# Altium project ArDINo.PrjPCB
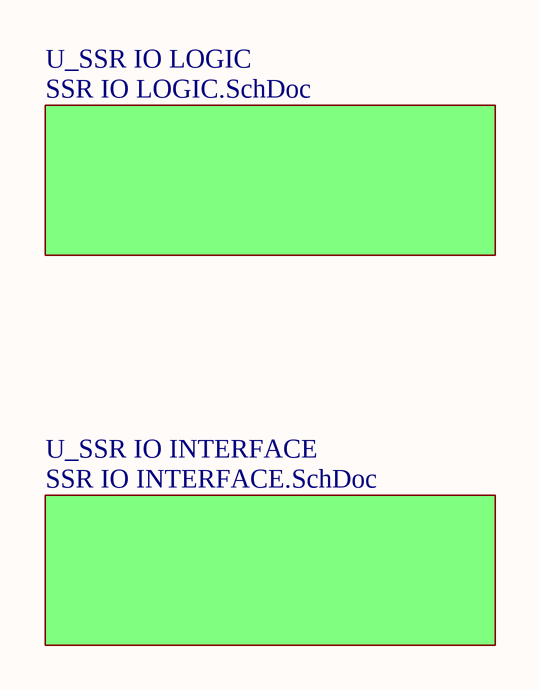
[diagram p0: DINOBUS.SchDoc]
4 sheets, 152 parts. Net scope: global (net labels, ports and power ports of the same name join across sheets).
Board files: SSR IO INTERFACE.PcbDoc, DINOBUS NODE CONTROLLER.PcbDoc, DUAL OC OUTPUT.PcbDoc
Sheets:
  DINOBUS.SchDoc
    U_SSR IO INTERFACE = SSR IO INTERFACE.SchDoc
  DINOBUS NODE CONTROLLER.SchDoc
  DUAL OC OUTPUT.SchDoc

## Sheet DINOBUS.SchDoc: document title
size C; ApprovedBy: Vincent Himpe; CheckedBy: Vincent Himpe; Author: Vincent Himpe; CompanyName: STMicroelectronics; DrawnBy: Vincent Himpe; Organization: BCD Application; Address1: 2525 Augustine Drive; Address2: Santa Clara 95054 CA; Address3: USA; Revision: A; Project: Project title; DrawnByContact: +1 (408) 451 8116; DrawnByEmail: vincent.himpe@st.com

### Sub-sheets
U_SSR IO INTERFACE = SSR IO INTERFACE.SchDoc: no entries
U_SSR IO LOGIC = SSR IO LOGIC.SchDoc (file not in this document): no entries

### Notes on the sheet
- PROJECT
- STMicroelectronics
- Last Modified
- Sheet
- of
- Document
- Revision
- Drawn By
- Information in this document is the intellectual property of STMicroelectronics.Disclosure outside of STMicroelectronics is prohibited without prior written approval. Contents may be subject to Patent or Patent application.
- 2525 Augustine Drive
- Santa Clara 95054 CA
- USA

## Sheet SSR IO INTERFACE.SchDoc: document title
size C; ApprovedBy: Vincent Himpe; CheckedBy: Vincent Himpe; Author: Vincent Himpe; CompanyName: STMicroelectronics; DrawnBy: Vincent Himpe; Organization: BCD Application; Address1: 2525 Augustine Drive; Address2: Santa Clara 95054 CA; Address3: USA; Revision: A; Project: Project title; DrawnByContact: +1 (408) 451 8116; DrawnByEmail: vincent.himpe@st.com
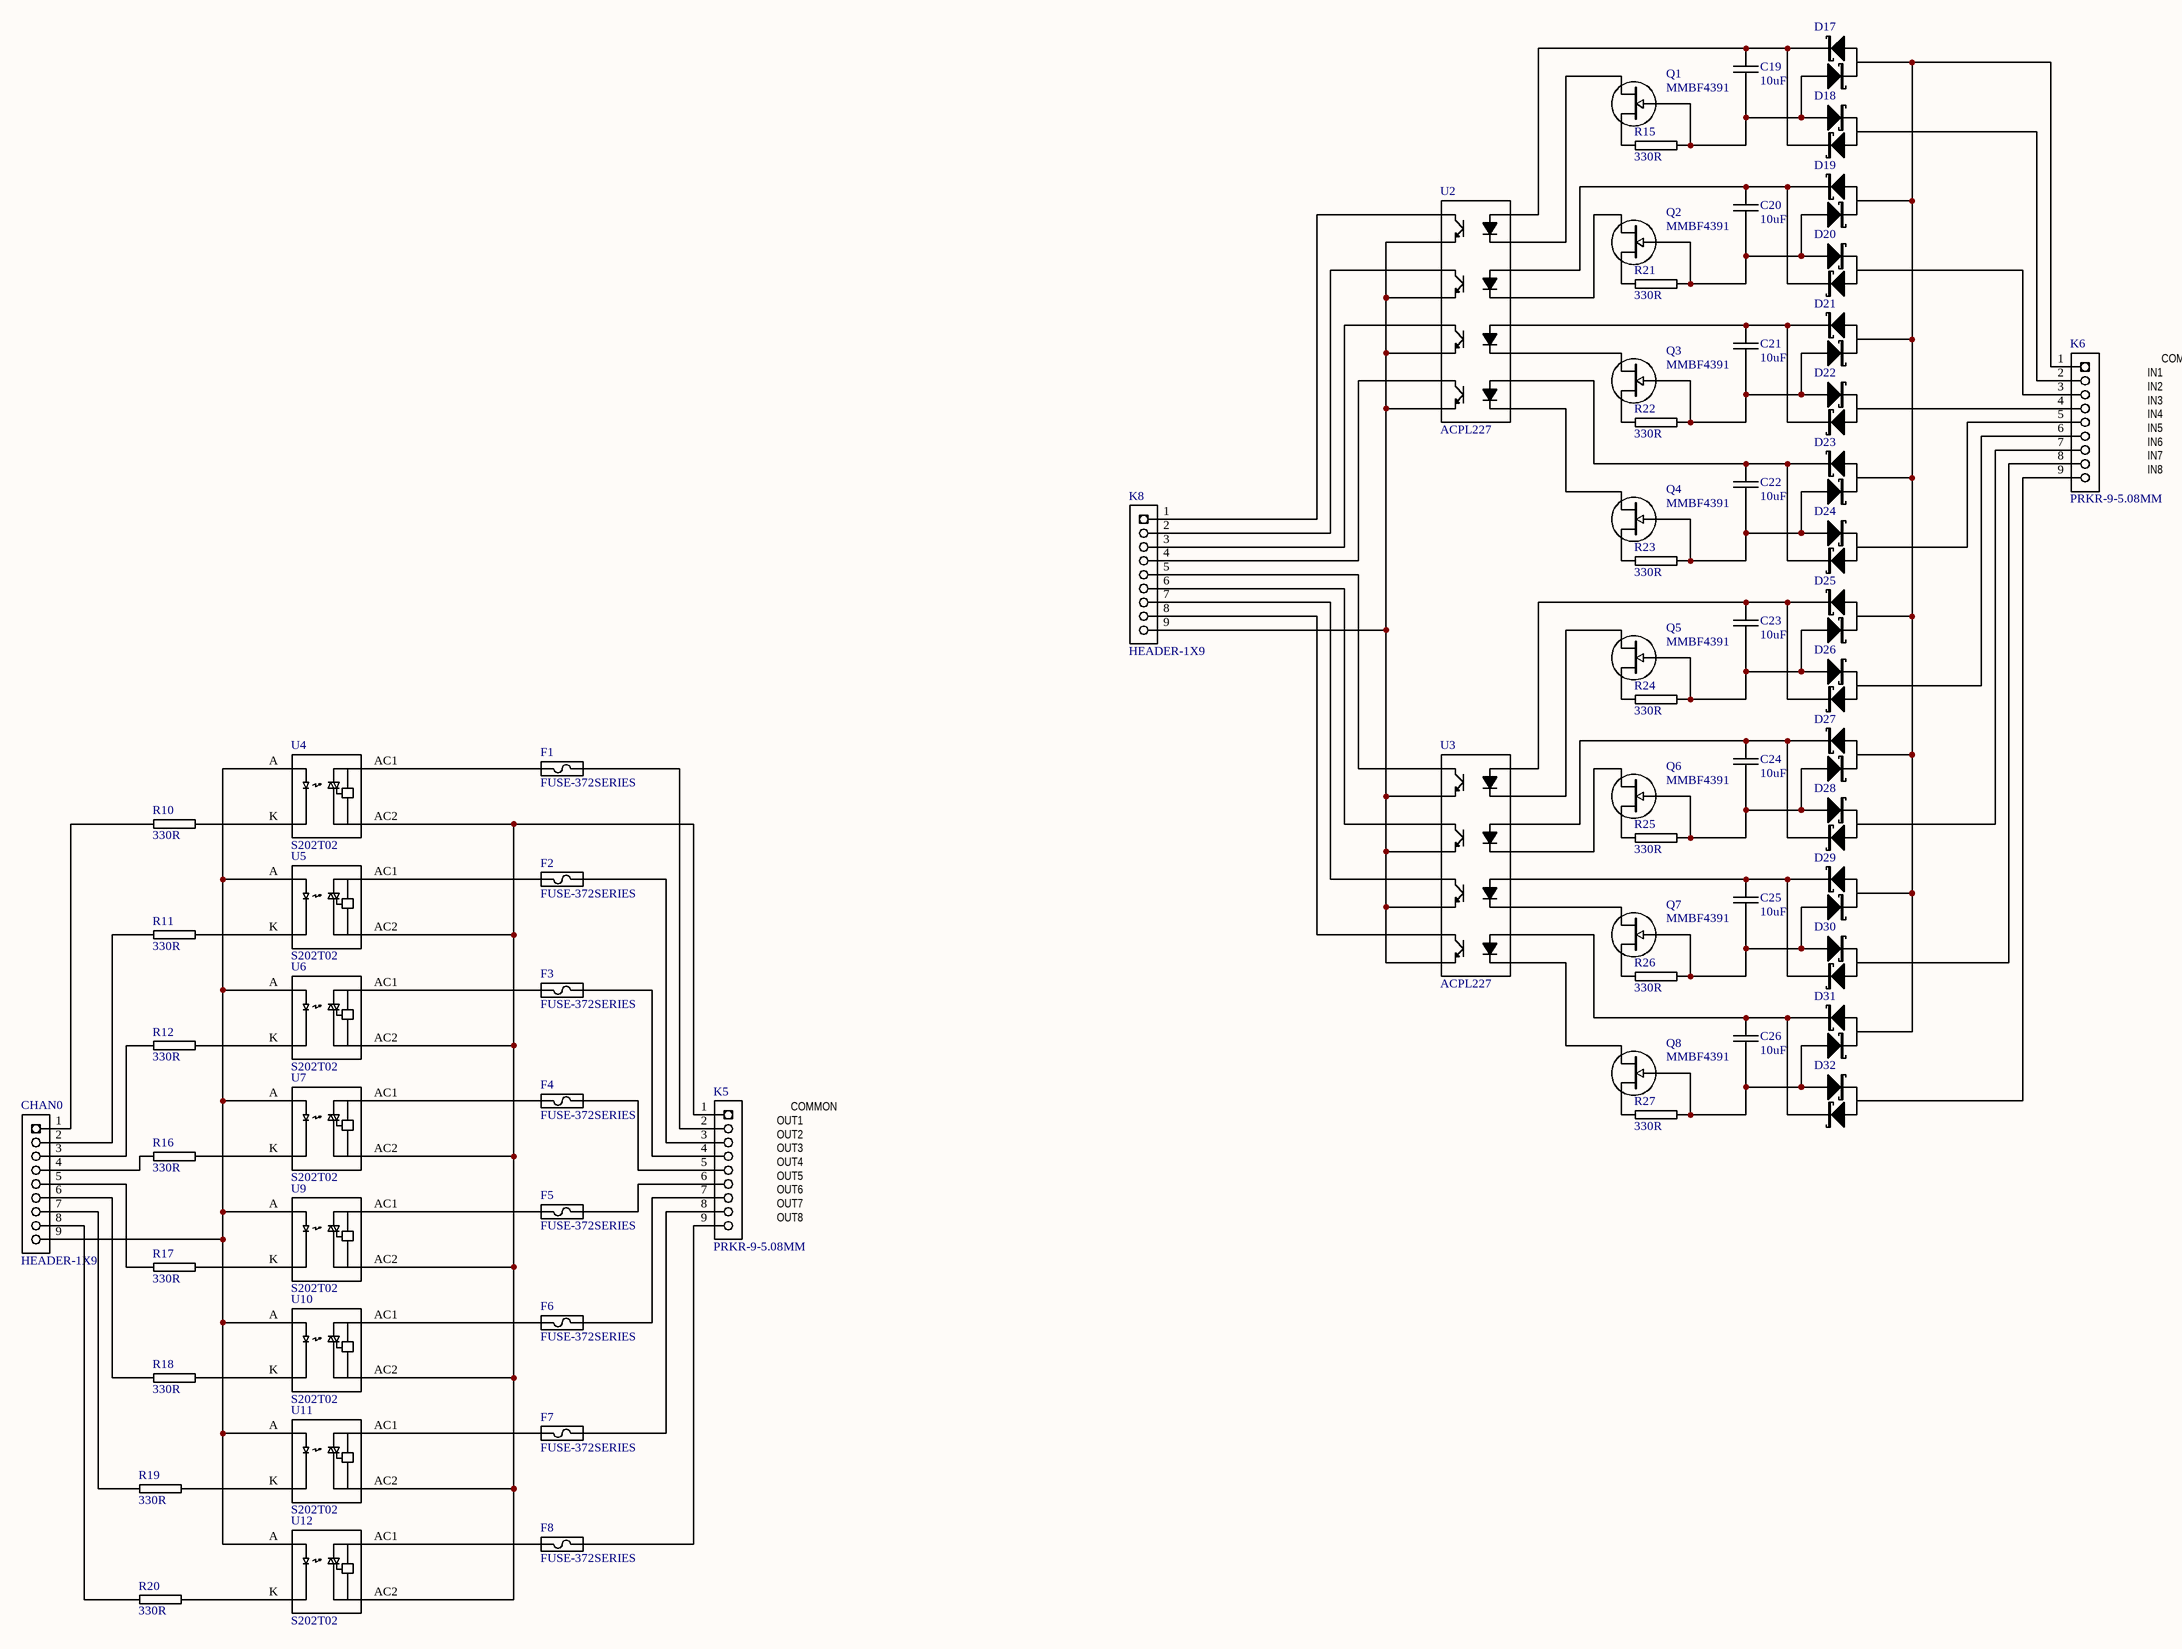
[diagram p1: SSR IO INTERFACE.SchDoc]

### Parts
(Parts that share a designator on the sheet are numbered #1, #2 ... from top to bottom, then left to right.)
C19  10uF  [1210C-GENERIC]
C20  10uF  [1210C-GENERIC]
C21  10uF  [1210C-GENERIC]
C22  10uF  [1210C-GENERIC]
C23  10uF  [1210C-GENERIC]
C24  10uF  [1210C-GENERIC]
C25  10uF  [1210C-GENERIC]
C26  10uF  [1210C-GENERIC]
CHAN0#1  HEADER-1X9  [HEADER-1X9]
D17  BAT54S-SOT23  [SOT23-123]  (value not drawn)
D18  BAT54S-SOT23  [SOT23-123]  (value not drawn)
D19  BAT54S-SOT23  [SOT23-123]  (value not drawn)
D20  BAT54S-SOT23  [SOT23-123]  (value not drawn)
D21  BAT54S-SOT23  [SOT23-123]  (value not drawn)
D22  BAT54S-SOT23  [SOT23-123]  (value not drawn)
D23  BAT54S-SOT23  [SOT23-123]  (value not drawn)
D24  BAT54S-SOT23  [SOT23-123]  (value not drawn)
D25  BAT54S-SOT23  [SOT23-123]  (value not drawn)
D26  BAT54S-SOT23  [SOT23-123]  (value not drawn)
D27  BAT54S-SOT23  [SOT23-123]  (value not drawn)
D28  BAT54S-SOT23  [SOT23-123]  (value not drawn)
D29  BAT54S-SOT23  [SOT23-123]  (value not drawn)
D30  BAT54S-SOT23  [SOT23-123]  (value not drawn)
D31  BAT54S-SOT23  [SOT23-123]  (value not drawn)
D32  BAT54S-SOT23  [SOT23-123]  (value not drawn)
F1#1  FUSE-372SERIES  [FUSE-372]
F2  FUSE-372SERIES  [FUSE-372]
F3  FUSE-372SERIES  [FUSE-372]
F4  FUSE-372SERIES  [FUSE-372]
F5  FUSE-372SERIES  [FUSE-372]
F6  FUSE-372SERIES  [FUSE-372]
F7  FUSE-372SERIES  [FUSE-372]
F8  FUSE-372SERIES  [FUSE-372]
K5#1  PRKR-9-5.08MM  [PRKR-9-5.08MM]
K6  PRKR-9-5.08MM  [PRKR-9-5.08MM]
K8  HEADER-1X9  [HEADER-1X9]
Q1#1  MMBF4391  [SOT23-DSG]
Q2  MMBF4391  [SOT23-DSG]
Q3  MMBF4391  [SOT23-DSG]
Q4  MMBF4391  [SOT23-DSG]
Q5  MMBF4391  [SOT23-DSG]
Q6  MMBF4391  [SOT23-DSG]
Q7  MMBF4391  [SOT23-DSG]
Q8  MMBF4391  [SOT23-DSG]
R10  330R  [0805R-330]
R11  330R  [0805R-330]
R12  330R  [0805R-330]
R15  330R  [0805R-330]
R16  330R  [0805R-330]
R17  330R  [0805R-330]
R18  330R  [0805R-330]
R19  330R  [0805R-330]
R20  330R  [0805R-330]
R21  330R  [0805R-330]
R22  330R  [0805R-330]
R23  330R  [0805R-330]
R24  330R  [0805R-330]
R25  330R  [0805R-330]
R26  330R  [0805R-330]
R27  330R  [0805R-330]
U2#1  ACPL227  [SO16]
U3#1  ACPL227  [SO16]
U4#1  S202T02  [S202T02]
U5#1  S202T02  [S202T02]
U6  S202T02  [S202T02]
U7  S202T02  [S202T02]
U9  S202T02  [S202T02]
U10  S202T02  [S202T02]
U11  S202T02  [S202T02]
U12  S202T02  [S202T02]

### Nets
NetC19_1: C19.1 D17.2 D18.2 U2#1.1(A1)
NetC19_2: C19.2 D17.1 D18.1 Q1#1.G R15.2
NetC20_1: C20.1 D19.2 D20.2 U2#1.3(A2)
NetC20_2: C20.2 D19.1 D20.1 Q2.G R21.2
NetC21_1: C21.1 D21.2 D22.2 U2#1.5(A3)
NetC21_2: C21.2 D21.1 D22.1 Q3.G R22.2
NetC22_1: C22.1 D23.2 D24.2 U2#1.7(A4)
NetC22_2: C22.2 D23.1 D24.1 Q4.G R23.2
NetC23_1: C23.1 D25.2 D26.2 U3#1.1(A1)
NetC23_2: C23.2 D25.1 D26.1 Q5.G R24.2
NetC24_1: C24.1 D27.2 D28.2 U3#1.3(A2)
NetC24_2: C24.2 D27.1 D28.1 Q6.G R25.2
NetC25_1: C25.1 D29.2 D30.2 U3#1.5(A3)
NetC25_2: C25.2 D29.1 D30.1 Q7.G R26.2
NetC26_1: C26.1 D31.2 D32.2 U3#1.7(A4)
NetC26_2: C26.2 D31.1 D32.1 Q8.G R27.2
NetCHAN0#1_1: CHAN0#1.1 R10.1
NetCHAN0#1_2: CHAN0#1.2 R11.1
NetCHAN0#1_3: CHAN0#1.3 R12.1
NetCHAN0#1_4: CHAN0#1.4 R16.1
NetCHAN0#1_5: CHAN0#1.5 R17.1
NetCHAN0#1_6: CHAN0#1.6 R18.1
NetCHAN0#1_7: CHAN0#1.7 R19.1
NetCHAN0#1_8: CHAN0#1.8 R20.1
NetCHAN0#1_9: CHAN0#1.9 U4#1.A U5#1.A U6.A U7.A U9.A U10.A U11.A U12.A
NetD17_3: D17.3 D19.3 D21.3 D23.3 D25.3 D27.3 D29.3 D31.3 K6.1
NetD18_3: D18.3 K6.2
NetD20_3: D20.3 K6.3
NetD22_3: D22.3 K6.4
NetD24_3: D24.3 K6.5
NetD26_3: D26.3 K6.6
NetD28_3: D28.3 K6.7
NetD30_3: D30.3 K6.8
NetD32_3: D32.3 K6.9
NetF1#1_1: F1#1.1 K5#1.2
NetF1#1_2: F1#1.2 U4#1.AC1
NetF2_1: F2.1 K5#1.3
NetF2_2: F2.2 U5#1.AC1
NetF3_1: F3.1 K5#1.4
NetF3_2: F3.2 U6.AC1
NetF4_1: F4.1 K5#1.5
NetF4_2: F4.2 U7.AC1
NetF5_1: F5.1 K5#1.6
NetF5_2: F5.2 U9.AC1
NetF6_1: F6.1 K5#1.7
NetF6_2: F6.2 U10.AC1
NetF7_1: F7.1 K5#1.8
NetF7_2: F7.2 U11.AC1
NetF8_1: F8.1 K5#1.9
NetF8_2: F8.2 U12.AC1
NetK5#1_1: K5#1.1 U4#1.AC2 U5#1.AC2 U6.AC2 U7.AC2 U9.AC2 U10.AC2 U11.AC2 U12.AC2
NetK8_1: K8.1 U2#1.16(C1)
NetK8_2: K8.2 U2#1.14(C2)
NetK8_3: K8.3 U2#1.12(C3)
NetK8_4: K8.4 U2#1.10(C4)
NetK8_5: K8.5 U3#1.16(C1)
NetK8_6: K8.6 U3#1.14(C2)
NetK8_7: K8.7 U3#1.12(C3)
NetK8_8: K8.8 U3#1.10(C4)
NetK8_9: K8.9 U2#1.9(E4) U2#1.11(E3) U2#1.13(E2) U2#1.15(E1) U3#1.9(E4) U3#1.11(E3) U3#1.13(E2) U3#1.15(E1)
NetQ1#1_D: Q1#1.D U2#1.2(K1)
NetQ1#1_S: Q1#1.S R15.1
NetQ2_D: Q2.D U2#1.4(K2)
NetQ2_S: Q2.S R21.1
NetQ3_D: Q3.D U2#1.6(K3)
NetQ3_S: Q3.S R22.1
NetQ4_D: Q4.D U2#1.8(K4)
NetQ4_S: Q4.S R23.1
NetQ5_D: Q5.D U3#1.2(K1)
NetQ5_S: Q5.S R24.1
NetQ6_D: Q6.D U3#1.4(K2)
NetQ6_S: Q6.S R25.1
NetQ7_D: Q7.D U3#1.6(K3)
NetQ7_S: Q7.S R26.1
NetQ8_D: Q8.D U3#1.8(K4)
NetQ8_S: Q8.S R27.1
NetR10_2: R10.2 U4#1.K
NetR11_2: R11.2 U5#1.K
NetR12_2: R12.2 U6.K
NetR16_2: R16.2 U7.K
NetR17_2: R17.2 U9.K
NetR18_2: R18.2 U10.K
NetR19_2: R19.2 U11.K
NetR20_2: R20.2 U12.K

### Notes on the sheet
- (near K6) IN1
- (near K6) IN2
- (near K6) IN3
- (near K6) COMMON
- (near K6) IN4
- (near K6) IN5
- (near K6) IN6
- (near K6) IN7
- (near K6) IN8
- (near K5#1) OUT1
- (near K5#1) OUT2
- (near K5#1) OUT3
- (near K5#1) OUT4
- (near K5#1) COMMON
- (near K5#1) OUT5
- (near K5#1) OUT6
- (near K5#1) OUT7
- (near K5#1) OUT8
- PROJECT
- STMicroelectronics
- Last Modified
- Sheet
- of
- Document
- Revision
- Drawn By
- Information in this document is the intellectual property of STMicroelectronics.Disclosure outside of STMicroelectronics is prohibited without prior written approval. Contents may be subject to Patent or Patent application.
- 2525 Augustine Drive
- Santa Clara 95054 CA
- USA

### Library data of the parts
C19-C26 = 1210C-10UF-50V-TDK: GENERIC CAPACITOR NON POLARISED 1210; REEL: C87; Supplier 1: Digi-Key; Supplier Part Number 1: 445-4537-2-ND
D17-D32 = BAT54S-SOT23: DUAL SCHOTTKY DIODE SERIES; Manufacturer Part Number: BAT54S,215; Manufacturer: NXP Semiconductors; Voltage - DC Reverse (Vr) (Max): 30V; Speed: Small Signal =< 200mA (Io), Any Speed; Current - Reverse Leakage @ Vr: 2µA @ 25V; Diode Configuration: 1 Pair Series Connection; Voltage - Forward (Vf) (Max) @ If: 800mV @ 100mA; Current - Average Rectified (Io) (per Diode): 200mA (DC); Reverse Recovery Time (trr): 5ns; Description: DIODE SCHOTTKY 30V DUAL SOT23; Supplier 1: Digi-Key; Supplier Part Number 1: 568-1614-1-ND; Diode Type: Schottky; Package / Case: SOT-23-3, TO-236-3, Micro3™, SSD3, SST3; Packaging: Cut Tape (CT); Mounting Type: Surface Mount; Supplier Part Number: 568-1614-1-ND; RoHS: RoHS Compliant; Supplier: Digi-Key; Category: Discrete Semiconductor Products
F1#1 F2-F8 = FUSE-372SERIES: FUSE-372
R10-R12 R15-R27 = 0805R-330: RESISTOR 0805 1/4 WATT THIN FILM; Reel: *
U2#1 U3#1 = ACPL227: QUAD OPTOCOUPLER; Supplier 1: Mouser; Supplier Part Number 1: 630-ACPL-227-50BE
CHAN0#1 K8 = HEADER-1X9: Supplier 1: Digi-Key; Supplier Part Number 1: S1011E-36-ND
K5#1 K6 = PRKR-9-5.08MM: Supplier 1: Digi-Key; Supplier Part Number 1: S1011E-36-ND
Q1#1 Q2-Q8 = MMBF4391: Supplier 1: Digi-Key; Supplier Part Number 1: MMBF4391LT1OSCT-ND
U4#1 U5#1 U6 U7 U9-U12 = S202T02: Supplier 1: Digi-Key; Supplier Part Number 1: 425-2374-5-ND

## Sheet DINOBUS NODE CONTROLLER.SchDoc: document title
size C; ApprovedBy: Vincent Himpe; CheckedBy: Vincent Himpe; Author: Vincent Himpe; CompanyName: STMicroelectronics; DrawnBy: Vincent Himpe; Organization: BCD Application; Address1: 2525 Augustine Drive; Address2: Santa Clara 95054 CA; Address3: USA; Revision: A; Project: Project title; DrawnByContact: +1 (408) 451 8116; DrawnByEmail: vincent.himpe@st.com
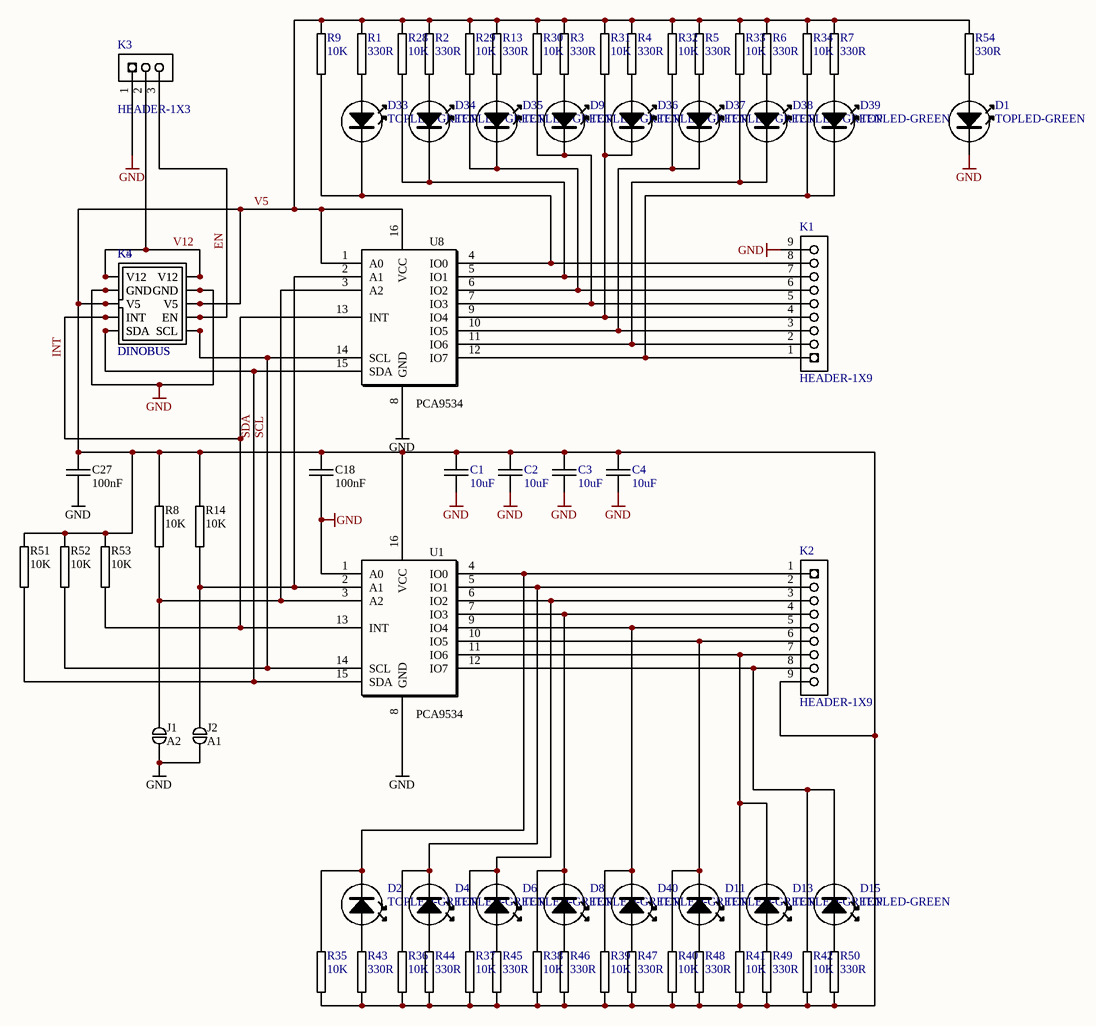
[diagram p2: DINOBUS NODE CONTROLLER.SchDoc]

### Parts
(Parts that share a designator on the sheet are numbered #1, #2 ... from top to bottom, then left to right.)
C1  10uF  [0805C-GENERIC]
C2  10uF  [0805C-GENERIC]
C3  10uF  [0805C-GENERIC]
C4  10uF  [0805C-GENERIC]
C18  100nF  [0805C]
C27  100nF  [0805C]
D1  TOPLED-GREEN  [TOPLED-GREEN]
D2  TOPLED-GREEN  [TOPLED-GREEN]
D4  TOPLED-GREEN  [TOPLED-GREEN]
D6  TOPLED-GREEN  [TOPLED-GREEN]
D8  TOPLED-GREEN  [TOPLED-GREEN]
D9  TOPLED-GREEN  [TOPLED-GREEN]
D11  TOPLED-GREEN  [TOPLED-GREEN]
D13  TOPLED-GREEN  [TOPLED-GREEN]
D15  TOPLED-GREEN  [TOPLED-GREEN]
D33  TOPLED-GREEN  [TOPLED-GREEN]
D34  TOPLED-GREEN  [TOPLED-GREEN]
D35  TOPLED-GREEN  [TOPLED-GREEN]
D36  TOPLED-GREEN  [TOPLED-GREEN]
D37  TOPLED-GREEN  [TOPLED-GREEN]
D38  TOPLED-GREEN  [TOPLED-GREEN]
D39  TOPLED-GREEN  [TOPLED-GREEN]
D40  TOPLED-GREEN  [TOPLED-GREEN]
J1  A2  [BYPASS]
J2  A1  [BYPASS]
K1  HEADER-1X9  [HEADER-1X9]
K2  HEADER-1X9  [HEADER-1X9]
K3#1  HEADER-1X3  [HEADER-1X3]
K4  DINOBUS  [IDC10-B]
K5#2  DINOBUS  [IDC10-B]
R1  330R  [0805R-330]
R2  330R  [0805R-330]
R3  330R  [0805R-330]
R4  330R  [0805R-330]
R5  330R  [0805R-330]
R6  330R  [0805R-330]
R7  330R  [0805R-330]
R8  10K  [0805R]
R9  10K  [0805R-10K]
R13  330R  [0805R-330]
R14  10K  [0805R]
R28  10K  [0805R-10K]
R29  10K  [0805R-10K]
R30  10K  [0805R-10K]
R31  10K  [0805R-10K]
R32  10K  [0805R-10K]
R33  10K  [0805R-10K]
R34  10K  [0805R-10K]
R35  10K  [0805R-10K]
R36  10K  [0805R-10K]
R37  10K  [0805R-10K]
R38  10K  [0805R-10K]
R39  10K  [0805R-10K]
R40  10K  [0805R-10K]
R41  10K  [0805R-10K]
R42  10K  [0805R-10K]
R43  330R  [0805R-330]
R44  330R  [0805R-330]
R45  330R  [0805R-330]
R46  330R  [0805R-330]
R47  330R  [0805R-330]
R48  330R  [0805R-330]
R49  330R  [0805R-330]
R50  330R  [0805R-330]
R51  10K  [0805R]
R52  10K  [0805R]
R53  10K  [0805R]
R54  330R  [0805R-330]
U1#1  PCA9534  [SO16W]
U8  PCA9534  [SO16W]

### Nets
GND: C1.2 C2.2 C3.2 C4.2 C18.2 C27.2 D1.K J1.2 J2.2 K1.9 K3#1.1 K4.3(GND) K4.4(GND) K5#2.3(GND) K5#2.4(GND) U1#1.1(A0) U1#1.8(GND) U8.8(GND)
EN: K3#1.3 K4.8(EN) K5#2.8(EN)
INT: K4.7(INT) K5#2.7(INT) R53.1 U1#1.13(INT) U8.13(INT)
SCL: K4.10(SCL) K5#2.10(SCL) R52.1 U1#1.14(SCL) U8.14(SCL)
SDA: K4.9(SDA) K5#2.9(SDA) R51.1 U1#1.15(SDA) U8.15(SDA)
V5: C1.1 C2.1 C3.1 C4.1 C18.1 C27.1 K2.9 K4.5(V5) K4.6(V5) K5#2.5(V5) K5#2.6(V5) R1.2 R2.2 R3.2 R4.2 R5.2 R6.2 R7.2 R8.2 R9.2 R13.2 R14.2 R28.2 R29.2 R30.2 R31.2 R32.2 R33.2 R34.2 R35.2 R36.2 R37.2 R38.2 R39.2 R40.2 R41.2 R42.2 R43.2 R44.2 R45.2 R46.2 R47.2 R48.2 R49.2 R50.2 R51.2 R52.2 R53.2 R54.2 U1#1.16(VCC) U8.1(A0) U8.16(VCC)
V12: K3#1.2 K4.1(V12) K4.2(V12) K5#2.1(V12) K5#2.2(V12)
NetD1_A: D1.A R54.1
NetD2_A: D2.A R43.1
NetD2_K: D2.K K2.1 R35.1 U1#1.4(IO0)
NetD4_A: D4.A R44.1
NetD4_K: D4.K K2.2 R36.1 U1#1.5(IO1)
NetD6_A: D6.A R45.1
NetD6_K: D6.K K2.3 R37.1 U1#1.6(IO2)
NetD8_A: D8.A R46.1
NetD8_K: D8.K K2.4 R38.1 U1#1.7(IO3)
NetD9_A: D9.A R3.1
NetD9_K: D9.K K1.5 R30.1 U8.7(IO3)
NetD11_A: D11.A R48.1
NetD11_K: D11.K K2.6 R40.1 U1#1.10(IO5)
NetD13_A: D13.A R49.1
NetD13_K: D13.K K2.7 R41.1 U1#1.11(IO6)
NetD15_A: D15.A R50.1
NetD15_K: D15.K K2.8 R42.1 U1#1.12(IO7)
NetD33_A: D33.A R1.1
NetD33_K: D33.K K1.8 R9.1 U8.4(IO0)
NetD34_A: D34.A R2.1
NetD34_K: D34.K K1.7 R28.1 U8.5(IO1)
NetD35_A: D35.A R13.1
NetD35_K: D35.K K1.6 R29.1 U8.6(IO2)
NetD36_A: D36.A R4.1
NetD36_K: D36.K K1.4 R31.1 U8.9(IO4)
NetD37_A: D37.A R5.1
NetD37_K: D37.K K1.3 R32.1 U8.10(IO5)
NetD38_A: D38.A R6.1
NetD38_K: D38.K K1.2 R33.1 U8.11(IO6)
NetD39_A: D39.A R7.1
NetD39_K: D39.K K1.1 R34.1 U8.12(IO7)
NetD40_A: D40.A R47.1
NetD40_K: D40.K K2.5 R39.1 U1#1.9(IO4)
NetJ1_1: J1.1 R8.1 U1#1.3(A2) U8.3(A2)
NetJ2_1: J2.1 R14.1 U1#1.2(A1) U8.2(A1)

### Notes on the sheet
- PROJECT
- STMicroelectronics
- Last Modified
- Sheet
- of
- Document
- Revision
- Drawn By
- Information in this document is the intellectual property of STMicroelectronics.Disclosure outside of STMicroelectronics is prohibited without prior written approval. Contents may be subject to Patent or Patent application.
- 2525 Augustine Drive
- Santa Clara 95054 CA
- USA

### Library data of the parts
C1-C4 = 0805C-10UF-16V-X5R-TDK: CAPACITOR 0805 CERAMIC; Manufacturer Part Number: C2012X5R1C106M; Manufacturer: TDK Corporation; REEL: C63; Description: CAP CER 10UF 16V X5R 0805; Supplier 1: Digi-Key; Supplier Part Number 1: 445-4115-2-ND
C18 C27 = 0805C-100NF: CAPACITOR NONPOLARISED
J1 J2 = BYPASS
K4 K5#2 = DINOBUS: BOXHEADER 10 PIN; Manufacturer: Assmann Electronics Inc; Manufacturer Part Number: AWHW10G-0202-T-R; Connector Type: Header, Shrouded; Description: CONN HEADER LOW-PRO 10POS GOLD; Number of Positions: 10; Number of Positions Loaded: All; Pitch: 0.100" (2.54mm); Supplier 1: Digi-Key; Supplier Part Number 1: HRP10H-ND; Supplier: Digi-Key; Contact Type: Male Pin; RoHS: RoHS Compliant; Supplier Part Number: HRP10H-ND; Category: Connectors, Interconnects; Number of Rows: 2; Row Spacing: 0.100" (2.54mm); Contact Mating Length: -; Mounting Type: Through Hole; Termination: Solder; Fastening Type: -; Features: -; Contact Finish: Gold; Contact Finish Thickness: Flash; Color: Gray; Packaging: Tray
R1-R7 R13 R43-R50 R54 = 0805R-330: RESISTOR 0805 1/4 WATT THIN FILM; Reel: *
R8 R14 R51-R53 = 0805R-10K: RESISTOR VALUE AS INDICATED
R9 R28-R42 = 0805R-10k: RESISTOR 0805 1/4 WATT THIN FILM; Reel: *
U1#1 U8 = PCA9534: OCTAL PUSH PULL DRIVER I2C
K1 K2 = HEADER-1X9: Supplier 1: Digi-Key; Supplier Part Number 1: S1011E-36-ND
K3#1 = HEADER-1X3: Supplier 1: Digi-Key; Supplier Part Number 1: S1011E-36-ND

## Sheet DUAL OC OUTPUT.SchDoc
size A
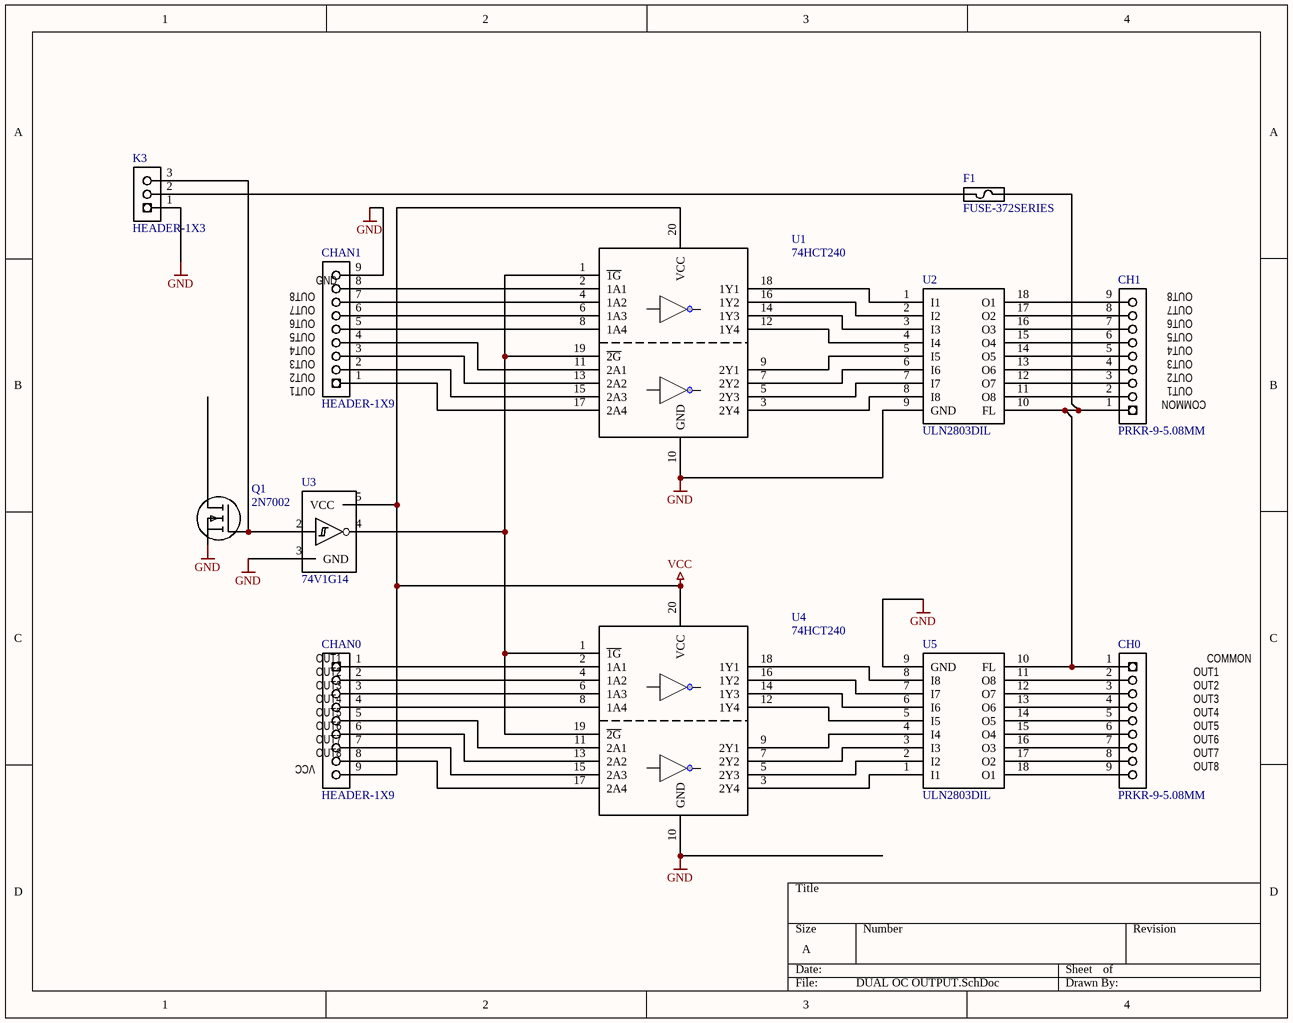
[diagram p3: DUAL OC OUTPUT.SchDoc]

### Parts
(Parts that share a designator on the sheet are numbered #1, #2 ... from top to bottom, then left to right.)
CH0  PRKR-9-5.08MM  [PRKR-9-5.08MM]
CH1  PRKR-9-5.08MM  [PRKR-9-5.08MM]
CHAN0#2  HEADER-1X9  [HEADER-1X9]
CHAN1  HEADER-1X9  [HEADER-1X9]
F1#2  FUSE-372SERIES  [FUSE-372]
K3#2  HEADER-1X3  [HEADER-1X3]
Q1#2  2N7002  [SOT23-GDS]
U1#2  74HCT240  [DIP20]
U2#2  ULN2803DIL  [DIP18]
U3#2  74V1G14  [SOT23-5]
U4#2  74HCT240  [DIP20]
U5#2  ULN2803DIL  [DIP18]

### Nets
GND: CHAN1.9 K3#2.1 Q1#2.S U1#2.10(GND) U2#2.9(GND) U3#2.3(GND) U4#2.10(GND) U5#2.9(GND)
VCC: CHAN0#2.9 U1#2.20(VCC) U3#2.5(VCC) U4#2.20(VCC)
NetCH0_1: CH0.1 CH1.1 F1#2.1 U2#2.10(FL) U5#2.10(FL)
NetCH0_2: CH0.2 U5#2.11(O8)
NetCH0_3: CH0.3 U5#2.12(O7)
NetCH0_4: CH0.4 U5#2.13(O6)
NetCH0_5: CH0.5 U5#2.14(O5)
NetCH0_6: CH0.6 U5#2.15(O4)
NetCH0_7: CH0.7 U5#2.16(O3)
NetCH0_8: CH0.8 U5#2.17(O2)
NetCH0_9: CH0.9 U5#2.18(O1)
NetCH1_2: CH1.2 U2#2.11(O8)
NetCH1_3: CH1.3 U2#2.12(O7)
NetCH1_4: CH1.4 U2#2.13(O6)
NetCH1_5: CH1.5 U2#2.14(O5)
NetCH1_6: CH1.6 U2#2.15(O4)
NetCH1_7: CH1.7 U2#2.16(O3)
NetCH1_8: CH1.8 U2#2.17(O2)
NetCH1_9: CH1.9 U2#2.18(O1)
NetCHAN0#2_1: CHAN0#2.1 U4#2.2(1A1)
NetCHAN0#2_2: CHAN0#2.2 U4#2.4(1A2)
NetCHAN0#2_3: CHAN0#2.3 U4#2.6(1A3)
NetCHAN0#2_4: CHAN0#2.4 U4#2.8(1A4)
NetCHAN0#2_5: CHAN0#2.5 U4#2.11(2A1)
NetCHAN0#2_6: CHAN0#2.6 U4#2.13(2A2)
NetCHAN0#2_7: CHAN0#2.7 U4#2.15(2A3)
NetCHAN0#2_8: CHAN0#2.8 U4#2.17(2A4)
NetCHAN1_1: CHAN1.1 U1#2.17(2A4)
NetCHAN1_2: CHAN1.2 U1#2.15(2A3)
NetCHAN1_3: CHAN1.3 U1#2.13(2A2)
NetCHAN1_4: CHAN1.4 U1#2.11(2A1)
NetCHAN1_5: CHAN1.5 U1#2.8(1A4)
NetCHAN1_6: CHAN1.6 U1#2.6(1A3)
NetCHAN1_7: CHAN1.7 U1#2.4(1A2)
NetCHAN1_8: CHAN1.8 U1#2.2(1A1)
NetF1#2_2: F1#2.2 K3#2.2
NetK3#2_3: K3#2.3 Q1#2.G U3#2.2
NetU1#2_1: U1#2.1(~{1G}) U1#2.19(~{2G}) U3#2.4 U4#2.1(~{1G}) U4#2.19(~{2G})
NetU1#2_3: U1#2.3(2Y4) U2#2.8(I8)
NetU1#2_5: U1#2.5(2Y3) U2#2.7(I7)
NetU1#2_7: U1#2.7(2Y2) U2#2.6(I6)
NetU1#2_9: U1#2.9(2Y1) U2#2.5(I5)
NetU1#2_12: U1#2.12(1Y4) U2#2.4(I4)
NetU1#2_14: U1#2.14(1Y3) U2#2.3(I3)
NetU1#2_16: U1#2.16(1Y2) U2#2.2(I2)
NetU1#2_18: U1#2.18(1Y1) U2#2.1(I1)
NetU4#2_3: U4#2.3(2Y4) U5#2.1(I1)
NetU4#2_5: U4#2.5(2Y3) U5#2.2(I2)
NetU4#2_7: U4#2.7(2Y2) U5#2.3(I3)
NetU4#2_9: U4#2.9(2Y1) U5#2.4(I4)
NetU4#2_12: U4#2.12(1Y4) U5#2.5(I5)
NetU4#2_14: U4#2.14(1Y3) U5#2.6(I6)
NetU4#2_16: U4#2.16(1Y2) U5#2.7(I7)
NetU4#2_18: U4#2.18(1Y1) U5#2.8(I8)

Not connected (* = marked no-connect by the designer): Q1#2 D

### Notes on the sheet
- (near CHAN1) GND
- (near CHAN1) OUT7
- (near CHAN1) OUT8
- (near CH1) OUT7
- (near CH1) OUT8
- (near CHAN1) OUT2
- (near CHAN1) OUT3
- (near CHAN1) OUT4
- (near CHAN1) OUT5
- (near CHAN1) OUT6
- (near CH1) OUT2
- (near CH1) OUT3
- (near CH1) OUT4
- (near CH1) OUT5
- (near CH1) OUT6
- (near CHAN1) OUT1
- (near CH1) OUT1
- (near CH1) COMMON
- (near CHAN0#2) OUT1
- (near CHAN0#2) OUT2
- (near CHAN0#2) OUT3
- (near CHAN0#2) OUT4
- (near CH0) OUT1
- (near CH0) OUT2
- (near CH0) OUT3
- (near CH0) COMMON
- (near CHAN0#2) VCC
- (near CHAN0#2) OUT5
- (near CHAN0#2) OUT6
- (near CHAN0#2) OUT7
- (near CHAN0#2) OUT8
- (near CH0) OUT4
- (near CH0) OUT5
- (near CH0) OUT6
- (near CH0) OUT7
- (near CH0) OUT8

### Library data of the parts
F1#2 = FUSE-372SERIES: FUSE-372
Q1#2 = 2N7002-SOT23: N CHANNEL MOSFET 2N7002 SOT23; Manufacturer: Fairchild Semiconductor; Drain to Source Voltage (Vdss): 60V; Vgs(th) (Max) @ Id: 2.5V @ 250µA; Power - Max: 200mW; Current - Continuous Drain (Id) @ 25° C: 115mA; Rds On (Max) @ Id, Vgs: 7.5 Ohm @ 500mA, 10V; FET Type: MOSFET N-Channel, Metal Oxide; FET Feature: Logic Level Gate; Input Capacitance (Ciss) @ Vds: 50pF @ 25V; Description: MOSFET N-CH 60V 115MA SOT-23; Reel: Q2; Supplier 1: Digi-Key; Supplier Part Number 1: 2N7002NTR-ND; Package / Case: SOT-23-3, TO-236-3, Micro3™, SSD3, SST3; RoHS: RoHS Compliant; Mounting Type: Surface Mount; Packaging: Tape & Reel (TR); Gate Charge (Qg) @ Vgs: -; Supplier Part Number: 2N7002NTR-ND; Supplier: Digi-Key; Category: Discrete Semiconductor Products; Manufacturer Part Number: 2N7002
U1#2 U4#2 = 74240DIL: 74240
U2#2 U5#2 = ULN2803DIL: OCTAL HIGH CURRENT DRIVER; Manufacturer: Texas Instruments; Manufacturer Part Number: ULN2803ADWR; Number of Drivers/Receivers: 8/0; Description: IC DARL TRANS ARRAY HV 18-SOIC; Voltage - Supply: 5V; Supplier 1: Digi-Key; Supplier Part Number 1: 296-15777-1-ND; Packaging: Cut Tape (CT); Supplier Part Number: 296-15777-1-ND; Type: Darlington Array; Supplier: Digi-Key; Protocol: -; Package / Case: 18-SOIC (7.5mm Width); Category: Integrated Circuits (ICs); RoHS: RoHS Compliant
U3#2 = 74V1G14: SINGLE GATE SCHMITTTRIGGER
CH0 CH1 = PRKR-9-5.08MM: Supplier 1: Digi-Key; Supplier Part Number 1: S1011E-36-ND
CHAN0#2 CHAN1 = HEADER-1X9: Supplier 1: Digi-Key; Supplier Part Number 1: S1011E-36-ND
K3#2 = HEADER-1X3: Supplier 1: Digi-Key; Supplier Part Number 1: S1011E-36-ND

## Nets that join several sheets
GND: DINOBUS NODE CONTROLLER (18 pins), DUAL OC OUTPUT (8 pins)